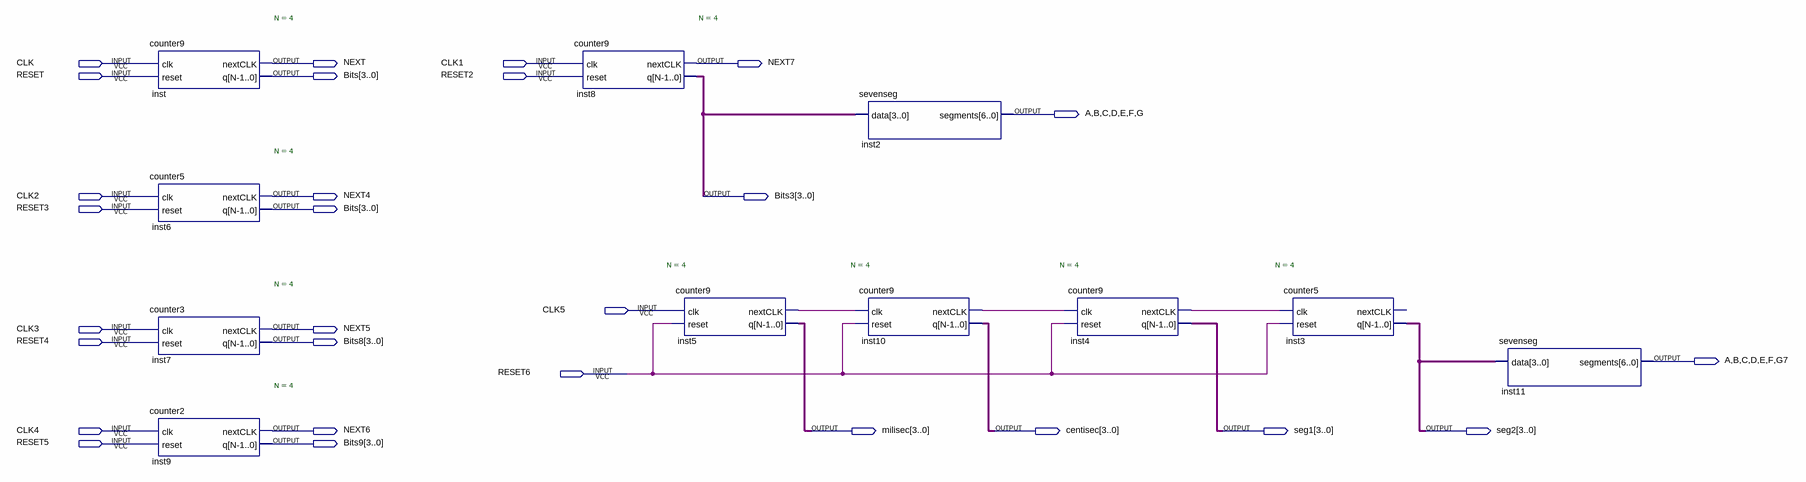
[diagram p0: schematic sheet]
// Quartus schematic BlockAuxiliar.bdf as structural Verilog: 11 symbols, 28 pins
module BlockAuxiliar (
  input  CLK,
  input  CLK1,
  input  RESET,
  input  RESET2,
  input  CLK2,
  input  RESET3,
  input  CLK5,
  input  CLK3,
  input  RESET4,
  input  RESET6,
  input  CLK4,
  input  RESET5,
  output NEXT,
  output NEXT7,
  output [3:0] Bits,
  output A,
  output B,
  output C,
  output D,
  output E,
  output F,
  output G,
  output NEXT4,
  output [3:0] Bits3,
  output NEXT5,
  output [3:0] Bits8,
  output G7,
  output NEXT6,
  output [3:0] milisec,
  output [3:0] centisec,
  output [3:0] seg1,
  output [3:0] seg2,
  output [3:0] Bits9
);

  wire inst4_nextclk, inst5_nextclk, inst10_nextclk;

  counter9 #(.N(4)) inst (.clk(CLK), .reset(RESET), .nextCLK(NEXT), .q(Bits));
  counter5 #(.N(4)) inst6 (.clk(CLK2), .reset(RESET3), .nextCLK(NEXT4), .q(Bits));
  counter3 #(.N(4)) inst7 (.clk(CLK3), .reset(RESET4), .nextCLK(NEXT5), .q(Bits8));
  counter2 #(.N(4)) inst9 (.clk(CLK4), .reset(RESET5), .nextCLK(NEXT6), .q(Bits9));
  counter9 #(.N(4)) inst8 (.clk(CLK1), .reset(RESET2), .nextCLK(NEXT7), .q(Bits3));
  counter9 #(.N(4)) inst5 (.clk(CLK5), .reset(RESET6), .nextCLK(inst5_nextclk), .q(milisec));
  sevenseg inst2 (.data(Bits3), .segments({A, B, C, D, E, F, G}));
  counter9 #(.N(4)) inst10 (.clk(inst5_nextclk), .reset(RESET6), .nextCLK(inst10_nextclk), .q(centisec));
  counter9 #(.N(4)) inst4 (.clk(inst10_nextclk), .reset(RESET6), .nextCLK(inst4_nextclk), .q(seg1));
  counter5 #(.N(4)) inst3 (.clk(inst4_nextclk), .reset(RESET6), .q(seg2));  // open: nextCLK
  sevenseg inst11 (.data(seg2), .segments({A, B, C, D, E, F, G7}));
endmodule
